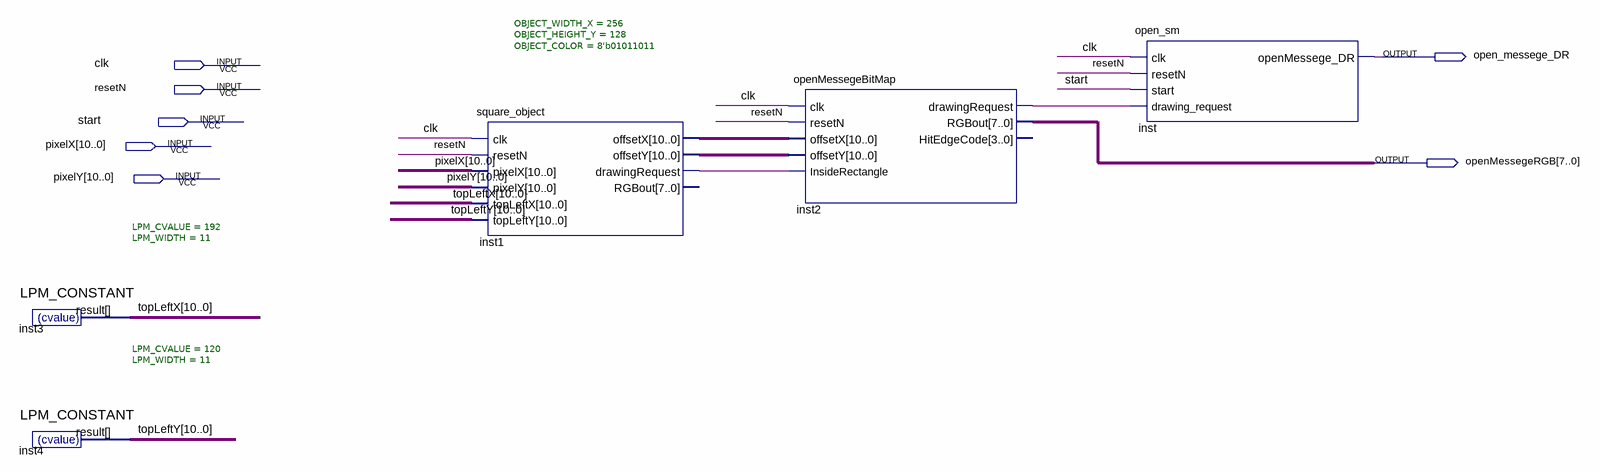
[diagram p0: schematic sheet]
// Quartus schematic open_messeg_block.bdf as structural Verilog: 5 symbols, 7 pins
module open_messeg_block (
  input  clk,
  input  resetN,
  input  start,
  input  [10:0] pixelX,
  input  [10:0] pixelY,
  output open_messege_DR,
  output [7:0] openMessegeRGB
);

  wire inst1_drawingrequest, inst2_drawingrequest;
  wire [10:0] inst1_offsetx, inst1_offsety, topLeftX, topLeftY;

  LPM_CONSTANT #(.LPM_CVALUE(192), .LPM_WIDTH(11)) inst3 (.result(topLeftX));
  LPM_CONSTANT #(.LPM_CVALUE(120), .LPM_WIDTH(11)) inst4 (.result(topLeftY));
  square_object #(.OBJECT_WIDTH_X(256), .OBJECT_HEIGHT_Y(128), .OBJECT_COLOR(8'b01011011)) inst1 (
    .clk(clk), .resetN(resetN), .pixelX(pixelX), .pixelY(pixelY), .topLeftX(topLeftX), .topLeftY(topLeftY),
    .offsetX(inst1_offsetx), .offsetY(inst1_offsety), .drawingRequest(inst1_drawingrequest));  // open: RGBout
  openMessegeBitMap inst2 (
    .clk(clk), .resetN(resetN), .offsetX(inst1_offsetx), .offsetY(inst1_offsety),
    .InsideRectangle(inst1_drawingrequest), .drawingRequest(inst2_drawingrequest), .RGBout(openMessegeRGB));  // open: HitEdgeCode
  open_sm inst (
    .clk(clk), .resetN(resetN), .start(start), .drawing_request(inst2_drawingrequest),
    .openMessege_DR(open_messege_DR));
endmodule
